# Altium schematic sheet ALU_AND.SchDoc
size B; Author: E. Sims; Organization: Let's Build Rockets Inc.; SheetNumber: 12; SheetTotal: 16
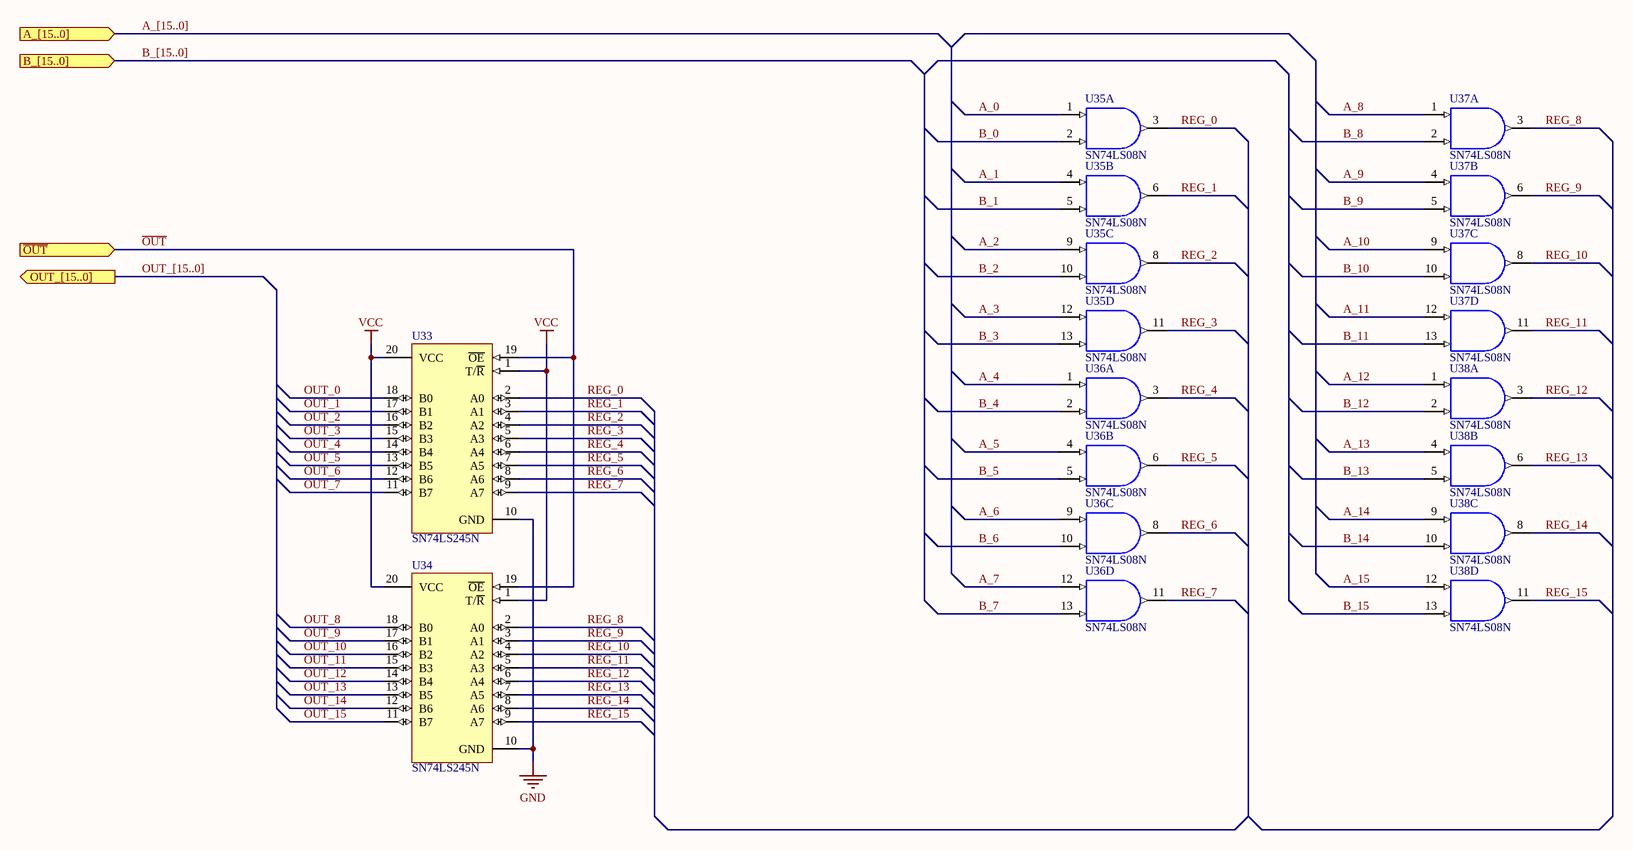
[diagram p0: ALU_AND.SchDoc]

## Parts
U33  SN74LS245N  [N020]
U34  SN74LS245N  [N020]
U35  SN74LS08N  [N014]  (parts A,B,C,D of 4)
U36  SN74LS08N  [N014]  (parts A,B,C,D of 4)
U37  SN74LS08N  [N014]  (parts A,B,C,D of 4)
U38  SN74LS08N  [N014]  (parts A,B,C,D of 4)

## Ports
A_[15..0] (in), B_[15..0] (in), OUT_[15..0] (out), ~{OUT} (in)

## Nets
GND: U33.10(GND) U34.10(GND) U35.7(GND) U36.7(GND) U37.7(GND) U38.7(GND)
VCC: U33.1(T/~{R}) U33.20(VCC) U34.1(T/~{R}) U34.20(VCC) U35.14(VCC) U36.14(VCC) U37.14(VCC) U38.14(VCC)
A_0: U35.1(A)
A_1: U35.4(A)
A_2: U35.9(A)
A_3: U35.12(A)
A_4: U36.1(A)
A_5: U36.4(A)
A_6: U36.9(A)
A_7: U36.12(A)
A_8: U37.1(A)
A_9: U37.4(A)
A_10: U37.9(A)
A_11: U37.12(A)
A_12: U38.1(A)
A_13: U38.4(A)
A_14: U38.9(A)
A_15: U38.12(A)
B_0: U35.2(B)
B_1: U35.5(B)
B_2: U35.10(B)
B_3: U35.13(B)
B_4: U36.2(B)
B_5: U36.5(B)
B_6: U36.10(B)
B_7: U36.13(B)
B_8: U37.2(B)
B_9: U37.5(B)
B_10: U37.10(B)
B_11: U37.13(B)
B_12: U38.2(B)
B_13: U38.5(B)
B_14: U38.10(B)
B_15: U38.13(B)
~{OUT}: U33.19(~{OE}) U34.19(~{OE}) ; port ~{OUT}
OUT_0: U33.18(B0)
OUT_1: U33.17(B1)
OUT_2: U33.16(B2)
OUT_3: U33.15(B3)
OUT_4: U33.14(B4)
OUT_5: U33.13(B5)
OUT_6: U33.12(B6)
OUT_7: U33.11(B7)
OUT_8: U34.18(B0)
OUT_9: U34.17(B1)
OUT_10: U34.16(B2)
OUT_11: U34.15(B3)
OUT_12: U34.14(B4)
OUT_13: U34.13(B5)
OUT_14: U34.12(B6)
OUT_15: U34.11(B7)
REG_0: U33.2(A0) U35.3(Y)
REG_1: U33.3(A1) U35.6(Y)
REG_2: U33.4(A2) U35.8(Y)
REG_3: U33.5(A3) U35.11(Y)
REG_4: U33.6(A4) U36.3(Y)
REG_5: U33.7(A5) U36.6(Y)
REG_6: U33.8(A6) U36.8(Y)
REG_7: U33.9(A7) U36.11(Y)
REG_8: U34.2(A0) U37.3(Y)
REG_9: U34.3(A1) U37.6(Y)
REG_10: U34.4(A2) U37.8(Y)
REG_11: U34.5(A3) U37.11(Y)
REG_12: U34.6(A4) U38.3(Y)
REG_13: U34.7(A5) U38.6(Y)
REG_14: U34.8(A6) U38.8(Y)
REG_15: U34.9(A7) U38.11(Y)

## Buses and harness runs
bus A_[15..0] = port A_[15..0]
bus B_[15..0] = port B_[15..0]
bus OUT_[15..0] = port OUT_[15..0]

## Notes on the sheet
- Let's Build Rocket's Inc. Modular Paylaod System Based on TMP-010 Rev
  For more information visit https://github.com/LetsBuildRockets/Modular-Payload-System
  This work is licensed under CC BY-NC 4.0. To view a copy of this license, visit https://creativecommons.org/licenses/by-nc/4.0
- Title
- Size:
- Date:
- Assembly Variant:
- B
- Number:
- Time:
- Revision:
- Sheet
- of
- Author:
- File:

## Library data of the parts
U33 U34 = SN74LS245N: Octal Bus Transceiver with 3-State Outputs; Published: 8-Jun-2000; LatestRevisionDate: 04-Mar-2005; LatestRevisionNote: Stylized 3D Model Added.; DatasheetVersion: Mar-1988; PackageVersion: Oct-1995; PackageReference: N020; Publisher: Altium Limited; PackageDescription: DIP; 20 Leads; Row Spacing 7.62 mm; Pitch 2.54 mm; ComponentLink1Description: Manufacturer Link; ComponentLink1URL: http://www.ti.com/; ComponentLink2Description: Datasheet; ComponentLink2URL: http://www-s.ti.com/sc/ds/sn74ls245.pdf
U35-U38 = SN74LS08N: Quadruple 2-Input Positive-AND Gate; Published: 8-Jun-2000; LatestRevisionDate: 04-Mar-2005; LatestRevisionNote: Stylized 3D Model Added.; DatasheetVersion: Mar-1988; PackageVersion: Oct-1995; PackageReference: N014; Publisher: Altium Limited; PackageDescription: DIP; 14 Leads; Row Spacing 7.62 mm; Pitch 2.54 mm; ComponentLink1Description: Manufacturer Link; ComponentLink1URL: http://www.ti.com/; ComponentLink2Description: Datasheet; ComponentLink2URL: http://www-s.ti.com/sc/ds/SN74LS08.pdf